# Altium schematic sheet TDC_VTUNE_DAC.SchDoc
size 420 x 297 mm; SheetNumber: 8; SheetTotal: 12; ModifiedBy: -; CheckedDate: -; Title2: Title 2; DivGrp: WUT ISE; Designer: G.Kasprowicz
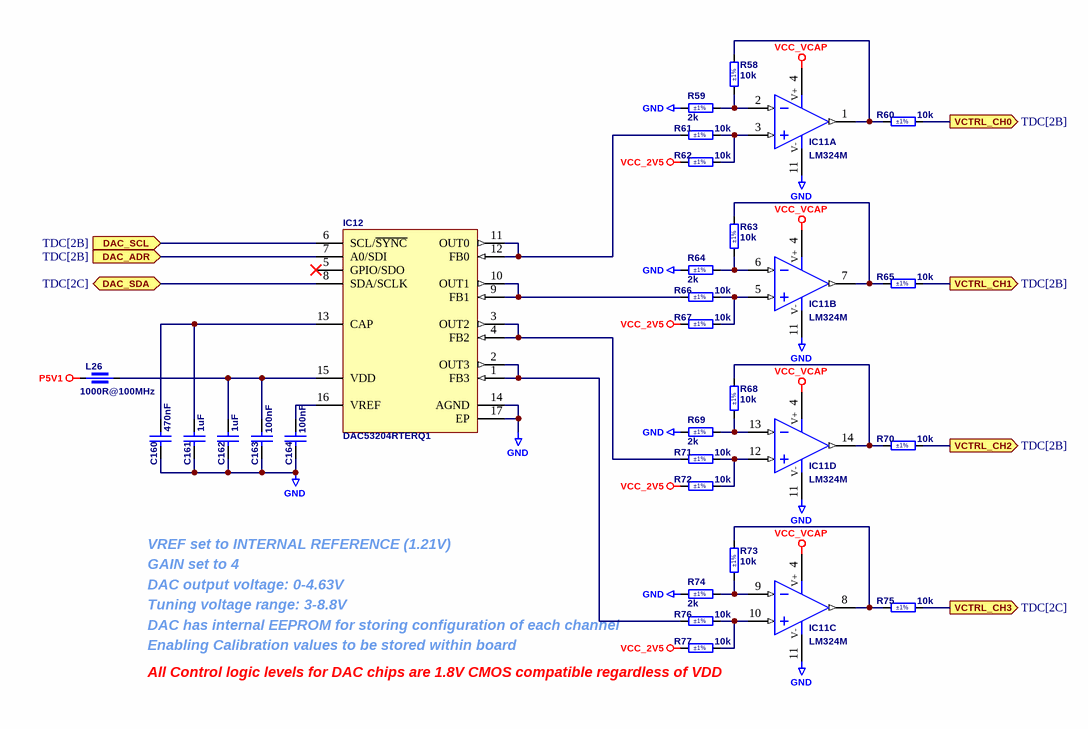
[diagram p0: TDC_VTUNE_DAC.SchDoc]

## Parts
C160  470nF  [CAPC1005X55N]
C161  1uF  [CAPC1005X55N]
C162  1uF  [CAPC1005X55N]
C163  100nF  [CAPC1005X55N]
C164  100nF  [CAPC1005X55N]
IC11  LM324M  [SOIC127P600X175-14N]  (parts A,B,C,D of 4)
IC12  DAC53204RTERQ1
L26  1000R@100MHz  [INDC1608X95N]
R58  10k  Tolerance: ±1%  [RESC1005X40N]
R59  2k  Tolerance: ±1%  [RESC1005X40N]
R60  10k  Tolerance: ±1%  [RESC1005X40N]
R61  10k  Tolerance: ±1%  [RESC1005X40N]
R62  10k  Tolerance: ±1%  [RESC1005X40N]
R63  10k  Tolerance: ±1%  [RESC1005X40N]
R64  2k  Tolerance: ±1%  [RESC1005X40N]
R65  10k  Tolerance: ±1%  [RESC1005X40N]
R66  10k  Tolerance: ±1%  [RESC1005X40N]
R67  10k  Tolerance: ±1%  [RESC1005X40N]
R68  10k  Tolerance: ±1%  [RESC1005X40N]
R69  2k  Tolerance: ±1%  [RESC1005X40N]
R70  10k  Tolerance: ±1%  [RESC1005X40N]
R71  10k  Tolerance: ±1%  [RESC1005X40N]
R72  10k  Tolerance: ±1%  [RESC1005X40N]
R73  10k  Tolerance: ±1%  [RESC1005X40N]
R74  2k  Tolerance: ±1%  [RESC1005X40N]
R75  10k  Tolerance: ±1%  [RESC1005X40N]
R76  10k  Tolerance: ±1%  [RESC1005X40N]
R77  10k  Tolerance: ±1%  [RESC1005X40N]

## Ports
DAC_ADR (in, see TDC[2B]), DAC_SCL (in, see TDC[2B]), DAC_SDA (bidir, see TDC[2C]), VCTRL_CH0 (out, see TDC[2B]), VCTRL_CH1 (out, see TDC[2B]), VCTRL_CH2 (out, see TDC[2B]), VCTRL_CH3 (out, see TDC[2C])

## Nets
GND: C160.1 C161.1 C162.1 C163.1 C164.1 IC11.11(V-) IC12.14(AGND) IC12.17(EP) R59.1 R64.1 R69.1 R74.1
P5V1: L26.1
VCC_2V5: R62.1 R67.1 R72.1 R77.1
VCC_VCAP: IC11.4(V+)
DAC_ADR: IC12.7(A0/SDI) ; port DAC_ADR
DAC_SCL: IC12.6(SCL/~{SYNC}) ; port DAC_SCL
DAC_SDA: IC12.8(SDA/SCLK) ; port DAC_SDA
VCTRL_CH0: R60.2 ; port VCTRL_CH0
VCTRL_CH1: R65.2 ; port VCTRL_CH1
VCTRL_CH2: R70.2 ; port VCTRL_CH2
VCTRL_CH3: R75.2 ; port VCTRL_CH3
NetC160_2: C160.2 C161.2 IC12.13(CAP)
NetC162_2: C162.2 C163.2 IC12.15(VDD) L26.2
NetC164_2: C164.2 IC12.16(VREF)
NetIC11_1: IC11.1(OUT) R58.2 R60.1
NetIC11_2: IC11.2(IN-) R58.1 R59.2
NetIC11_3: IC11.3(IN+) R61.2 R62.2
NetIC11_5: IC11.5(IN+) R66.2 R67.2
NetIC11_6: IC11.6(IN-) R63.1 R64.2
NetIC11_7: IC11.7(OUT) R63.2 R65.1
NetIC11_8: IC11.8(OUT) R73.2 R75.1
NetIC11_9: IC11.9(IN-) R73.1 R74.2
NetIC11_10: IC11.10(IN+) R76.2 R77.2
NetIC11_12: IC11.12(IN+) R71.2 R72.2
NetIC11_13: IC11.13(IN-) R68.1 R69.2
NetIC11_14: IC11.14(OUT) R68.2 R70.1
NetIC12_1: IC12.1(FB3) IC12.2(OUT3) R76.1
NetIC12_3: IC12.3(OUT2) IC12.4(FB2) R71.1
NetIC12_9: IC12.9(FB1) IC12.10(OUT1) R66.1
NetIC12_11: IC12.11(OUT0) IC12.12(FB0) R61.1

Not connected (* = marked no-connect by the designer): IC12 5(GPIO/SDO)*

## Notes on the sheet
- VREF set to INTERNAL REFERENCE (1.21V)
- GAIN set to 4
- DAC output voltage: 0-4.63V
- DAC has internal EEPROM for storing configuration of each channel
- Enabling Calibration values to be stored within board
- Tuning voltage range: 3-8.8V
- (near R77) All Control logic levels for DAC chips are 1.8V CMOS compatible regardless of VDD
- Project/Equipment
- Document
- Designer
- Drawn by
- Check.by
- Copyright WUT ISE 2024.
  This documentation describes Open Hardware and is licensed under the CERN OHL v.2. You may redistribute and modify this documentation under the terms of the CERN OHL v.2. (http://ohwr.org/CERNOHL). This documentation is distributed WITHOUT ANY EXPRESS OR IMPLIED WARRANTY, INCLUDING OF MERCHANTABILITY, SATISFACTORY QUALITY AND FITNESS FOR A PARTICULAR PURPOSE. Please see the CERN OHL v.2 for applicable conditions.
- Contact
- File
- Last Mod.
- Print Date
- Sheet
- Size
- A3
- of
- Rev

## Library data of the parts
C160 = CC0402_470NF_10V_10%_X7R: Non-polarised capacitor; Part Description: SMD Multilayer Chip Ceramic Capacitor; Manufacturer: GENERIC; Manufacturer1 Part Number: CC0402KRX7R6BB474; Voltage: 10V; TC: X7R; Tolerance: ±10%; Part Number: CC0402_470NF_10V_10%_X7R; Component Kind: Standard; Component Type: Standard; Pin Count: 2; Value: 470nF; Status: Not Recommended; Manufacturer Part Number: CC0402_470NF_10V_10%_X7R; Case: 0402; Mounted: Yes; Socket: No; SMD: Yes; Sense: No; Manufacturer1 Example: YAGEO PHYCOMP; Manufacturer1 ComponentHeight: 0.55mm; HelpURL: \\cern.ch\dfs\Applications\Altium\Datasheets\CC0402_X7R_YAGEO_6.3VTO50V.pdf; Author: CERN DEM BC; CreateDate: 12.11.2019; LatestRevisionDate: 12.11.2019
C161 C162 = CC0402_1UF_16V_10%_X5R: Non-polarised capacitor; Part Description: SMD Multilayer Chip Ceramic Capacitor; Manufacturer: GENERIC; Manufacturer1 Part Number: C1005X5R1C105KT; Voltage: 16V; TC: X5R; Tolerance: ±10%; Part Number: CC0402_1UF_16V_10%_X5R; Component Kind: Standard; Component Type: Standard; Pin Count: 2; Value: 1uF; Status: Preferred; Manufacturer Part Number: CC0402_1UF_16V_10%_X5R; Case: 0402; Mounted: Yes; Socket: No; SMD: Yes; Sense: No; Manufacturer1 Example: TDK; Manufacturer1 ComponentHeight: 0.55mm; HelpURL: \\cern.ch\dfs\Applications\Altium\Datasheets\CC0402_X5R_TDK_C.pdf; Author: CERN DEM JLC; CreateDate: 25.10.2012; LatestRevisionDate: 25.10.2012
C163 C164 = CC0402_100NF_16V_10%_X5R: Non-polarised capacitor; Part Description: SMD Multilayer Chip Ceramic Capacitor; Manufacturer: GENERIC; Manufacturer1 Part Number: GRM155R61C104KA88D; Voltage: 16V; TC: X5R; Tolerance: ±10%; Part Number: CC0402_100NF_16V_10%_X5R; Component Kind: Standard; Component Type: Standard; Pin Count: 2; Value: 100nF; Status: None; Manufacturer Part Number: CC0402_100NF_16V_10%_X5R; Case: 0402; Mounted: Yes; Socket: No; SMD: Yes; Sense: No; Manufacturer1 Example: MURATA; Manufacturer1 ComponentHeight: 0.55mm; HelpURL: \\cern.ch\dfs\Applications\Altium\Datasheets\CC0402_X5R_MURATA_GRM.pdf; Author: CERN DEM JLC; CreateDate: 10.12.2013; LatestRevisionDate: 10.12.2013
IC11 = LM324M: Quad Operational Amplifier; Manufacturer: FAIRCHILD SEMICONDUCTOR; PressFit: No; Bonding: No; Part Number: LM324M; Component Kind: Standard; Component Type: Standard; Device: LM324M; PackageDescription: SOIC 14, Pitch 1.27mm - Body 4x8.75mm, IPC Medium Density; Status: Not recommended; Part Description: Quad Operational Amplifier; Manufacturer Part Number: LM324M; Pin Count: 14; Case: SOIC14; Mounted: Yes; Socket: No; SMD: Yes; Sense: No; ComponentHeight: 1.80mm; Author: CERN DEM JLC; HelpURL: \\cern.ch\dfs\Applications\Altium\Datasheets\LM324M.pdf; CreateDate: 20.08.2008; LatestRevisionDate: 20.08.2008
IC12 = DAC53204-Q1: Digital to Analog Converters - DAC Automotive, 10-bit 4-channel voltage/current output smart DAC with Hi-Z, EEPROM, waveform generator 16-WQFN -40 to 125
L26 = IND0603_MURATA_BLM18KG102SN1: Part Description: SMD Chip Ferrite Bead, Automotive; Manufacturer: MURATA; Manufacturer Part Number: BLM18KG102WH1; Power: 1A; Resistance: 0.2R; Tolerance: ±25%; Part Number: IND0603_MURATA_BLM18KG102SN1; Component Kind: Standard; Component Type: Standard; Pin Count: 2; Value: 1000R@100MHz; Case: 0603; Mounted: Yes; Socket: No; SMD: Yes; Sense: No; ComponentHeight: 0.95mm; HelpURL: \\cern.ch\dfs\Applications\Altium\Datasheets\IND0603_MURATA_BLM18KG102SN1.pdf; Author: CERN DEM HF; CreateDate: 15.12.2022; LatestRevisionDate: 15.12.2022
R58 R60-R63 R65-R68 R70-R73 R75-R77 = R0402_10K_1%_0.0625W_100PPM: Resistor - 1%; Part Description: General Purpose Thick Film Chip Resistor; Manufacturer: GENERIC; Manufacturer1 Part Number: 232270671003L; TC: ±100ppm/°C; PressFit: No; Part Number: R0402_10K_1%_0.0625W_100PPM; Component Kind: Standard; Component Type: Standard; Pin Count: 2; Value: 10k; Status: Not Recommended; Power: 0.0625W; Manufacturer Part Number: R0402_10K_1%_0.0625W_100PPM; Case: 0402; Mounted: Yes; Sense: No; Socket: No; SMD: Yes; Manufacturer1 Example: YAGEO PHYCOMP; Manufacturer1 ComponentHeight: 0.4mm; HelpURL: \\cern.ch\dfs\Applications\Altium\Datasheets\R0402_Phycomp_RC0402.pdf; Author: CERN DEM JLC; CreateDate: 03.12.2007; LatestRevisionDate: 17.10.2012
R59 R64 R69 R74 = R0402_2K_1%_0.0625W_100PPM: Resistor - 1%; Part Description: General Purpose Thick Film Chip Resistor; Manufacturer: GENERIC; Manufacturer1 Part Number: 232270672002L; TC: ±100ppm/°C; PressFit: No; Part Number: R0402_2K_1%_0.0625W_100PPM; Component Kind: Standard; Component Type: Standard; Pin Count: 2; Value: 2k; Status: Not Recommended; Power: 0.0625W; Manufacturer Part Number: R0402_2K_1%_0.0625W_100PPM; Case: 0402; Mounted: Yes; Sense: No; Socket: No; SMD: Yes; Manufacturer1 Example: YAGEO PHYCOMP; Manufacturer1 ComponentHeight: 0.4mm; HelpURL: \\cern.ch\dfs\Applications\Altium\Datasheets\R0402_Phycomp_RC0402.pdf; Author: CERN DEM JLC; CreateDate: 03.12.2007; LatestRevisionDate: 17.10.2012